# Altium project SecuCar_KeyTag.PrjPcb
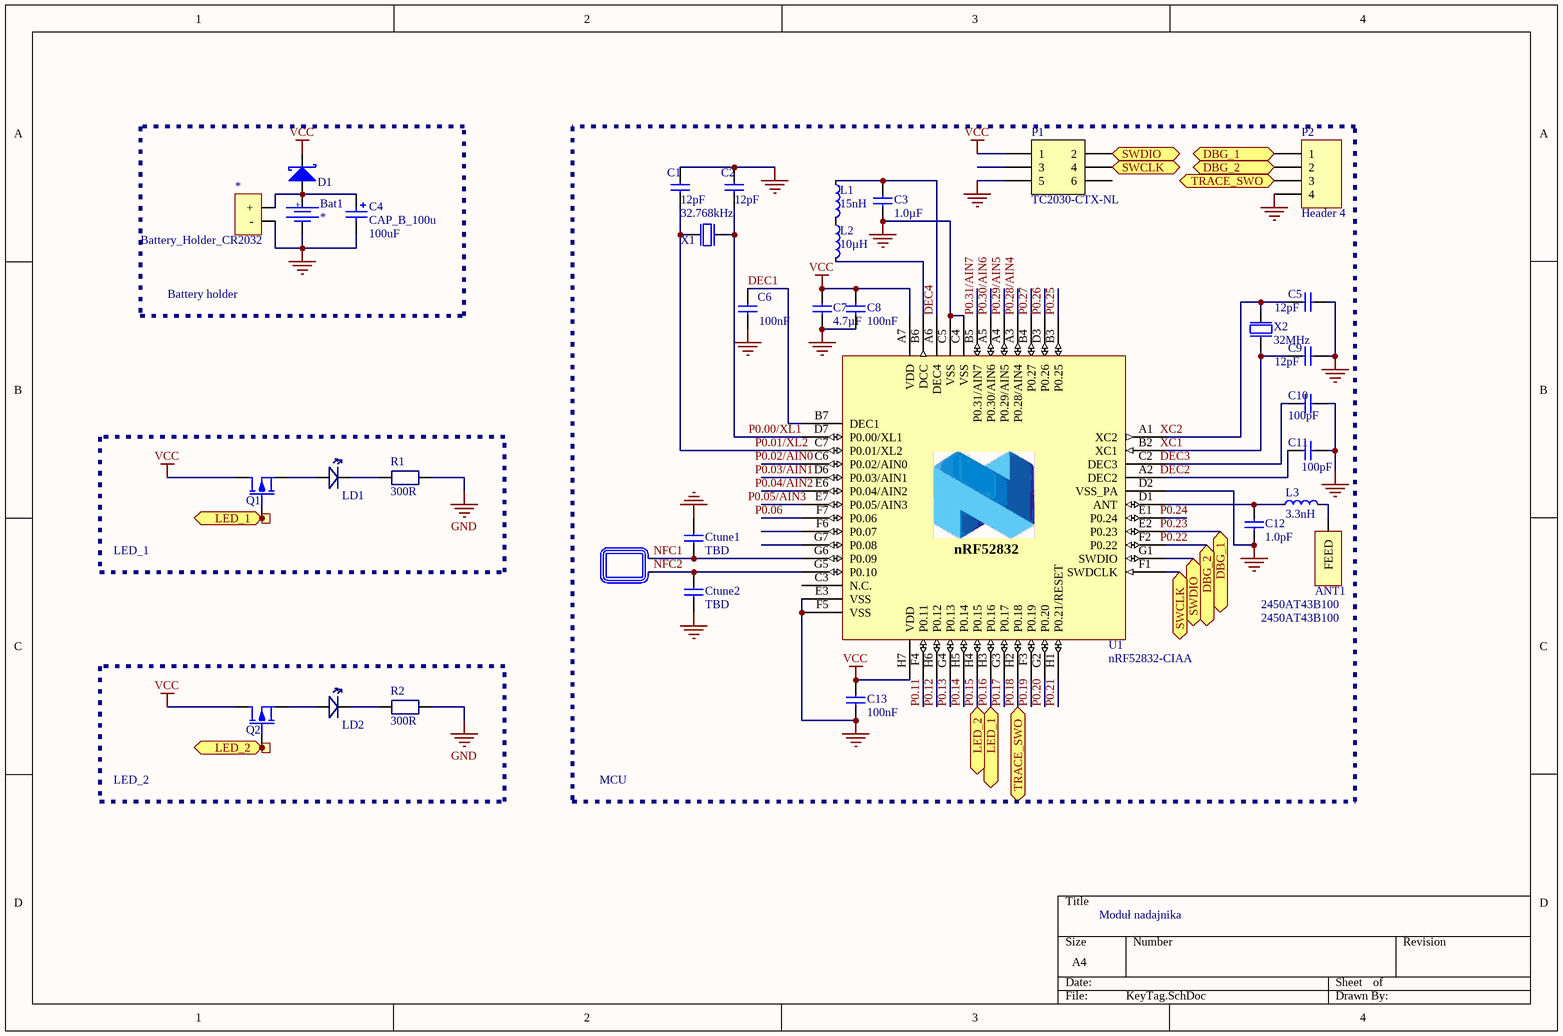
[diagram p0: KeyTag.SchDoc]
1 sheet, 36 parts. Net scope: flat (ports and power ports of the same name join across sheets).
Board file: KeyTagBoard.PcbDoc

## Sheet KeyTag.SchDoc
size A4

### Parts
2  Ø1.0mm,SMD  [TP_SMD_Ř1.0mm]  (value not drawn)  (no BOM)
3  Ø1.0mm,SMD  [TP_SMD_Ř1.0mm]  (value not drawn)  (no BOM)
*  Battery_Holder_CR2032  [CR2032_holder]
A1  NFC Antenna  [TP_2x1mm_TH]  (value not drawn)  (no BOM)
ANT1  2450AT43B100  [2450AT43B100]
Bat1  *  [CR1632_HOLDER_SMD]
C1  12pF  [CAPC0603X03L]
C2  12pF  [CAPC0603X03L]
C3  1.0µF  [CAPC1005X04L]
C4  CAP_B_100u  value 100uF  [B]
C5  12pF  [CAPC0603X03L]
C6  100nF  [CAPC0603X03L]
C7  4.7µF  [CAPC1608X06L]
C8  100nF  [CAPC0603X03L]
C9  12pF  [CAPC0603X03L]
C10  100pF  [CAPC0603X03L]
C11  100pF  [CAPC0603X03L]
C12  1.0pF  [CAPC0603X03L]
C13  100nF  [CAPC0603X03L]
Ctune1  TBD  [CAPC0603X03L]
Ctune2  TBD  [CAPC0603X03L]
D1  Shottky  [DO-214-AA]  (value not drawn)
L1  15nH  [INDC1005X04L]
L2  10µH  [INDC1608X06L]
L3  3.3nH  [INDC0603X03L]
LD1  0603_LED  [LED_0603]  (value not drawn)
LD2  0603_LED  [LED_0603]  (value not drawn)
P1  TC2030-CTX-NL  [TC2030-IDC-NLFP]  (no BOM)
P2  Header 4  [HDR1X4]
Q1  RZE002P02TLTR-ND  [SOT-416]  (value not drawn)
Q2  RZE002P02TLTR-ND  [SOT-416]  (value not drawn)
R1  value 300R  [RES_0402]  (hidden comment: RES_0402_1k)
R2  value 300R  [RES_0402]  (hidden comment: RES_0402_1k)
U1  nRF52832-CIAA  [BGA50C40P7X8_295X322X50]
X1  32.768kHz  [XTAL_2012]
X2  32MHz  [BT-XTAL_2016]

### Blocks framed on the sheet
Battery holder: * Bat1 C4 D1
MCU: A1 ANT1 C1-C3 C5-C13 Ctune1 Ctune2 L1-L3 P1 P2 U1 X1 X2
LED_1: 2 LD1 Q1 R1
LED_2: 3 LD2 Q2 R2

### Ports
DBG_1, DBG_2, LED_1, LED_2, SWCLK, SWDIO, SWDIO (bidir), TRACE_SWO

### Nets
GND: *.2(-) Bat1.2 C1.2 C2.2 C3.1 C4.2 C5.1 C6.2 C7.2 C8.2 C9.1 C10.2 C11.1 C12.1 C13.2 Ctune1.2 Ctune2.1 P1.5 P2.4 R1.1 R2.1 U1.C4(VSS) U1.C5(VSS) U1.D2(VSS_PA) U1.E3(VSS) U1.F5(VSS) X2.2(GND) X2.4(GND)
VCC: C7.1 C8.1 C13.1 D1.2 P1.1 Q1.3 Q2.3 U1.A7(VDD) U1.H7(VDD)
DEC1: C6.1 U1.B7(DEC1)
DEC4: C3.2 L1.1 U1.A6(DEC4)
NFC1: A1.2 Ctune1.1 U1.G6(P0.09)
NFC2: A1.1 Ctune2.2 U1.G5(P0.10)
P0.00/XL1: C2.1 U1.D7(P0.00/XL1) X1.2(out)
P0.01/XL2: C1.1 U1.C7(P0.01/XL2) X1.1(inp)
P0.11: U1.F4(P0.11)
P0.12: U1.H6(P0.12)
P0.13: U1.G4(P0.13)
P0.14: U1.H5(P0.14)
P0.15: 3.1 Q2.1 U1.H4(P0.15) ; port LED_2
P0.16: 2.1 Q1.1 U1.H3(P0.16) ; port LED_1
P0.17: U1.G3(P0.17)
P0.18: P2.3 U1.H2(P0.18) ; port TRACE_SWO
P0.19: U1.F3(P0.19)
P0.20: U1.G2(P0.20)
P0.21: U1.H1(P0.21/RESET)
P0.25: U1.B3(P0.25)
P0.26: U1.D3(P0.26)
P0.27: U1.B4(P0.27)
P0.28/AIN4: U1.A3(P0.28/AIN4)
P0.29/AIN5: U1.A4(P0.29/AIN5)
P0.30/AIN6: U1.A5(P0.30/AIN6)
P0.31/AIN7: U1.B5(P0.31/AIN7)
Net*_1: *.1(+) Bat1.1 C4.1 D1.1
NetANT1_1: ANT1.1(FEED) L3.2
NetC5_2: C5.2 U1.A1(XC2) X2.3(out)
NetC9_2: C9.2 U1.B2(XC1) X2.1(inp)
NetC10_1: C10.1 U1.C2(DEC3)
NetC11_2: C11.2 U1.A2(DEC2)
NetC12_2: C12.2 L3.1 U1.D1(ANT)
NetL1_2: L1.2 L2.1
NetL2_2: L2.2 U1.B6(DCC)
NetLD1_1: LD1.1(A) Q1.2
NetLD1_2: LD1.2(K) R1.2
NetLD2_1: LD2.1(A) Q2.2
NetLD2_2: LD2.2(K) R2.2
NetP1_2: P1.2 U1.G1(SWDIO) ; port SWDIO
NetP1_4: P1.4 U1.F1(SWDCLK) ; port SWCLK
NetP2_1: P2.1 U1.E2(P0.23) ; port DBG_1
NetP2_2: P2.2 U1.F2(P0.22) ; port DBG_2

Not connected (* = marked no-connect by the designer): P1 3 6; U1 C3(N.C.) C6(P0.02/AIN0) D6(P0.03/AIN1) E1(P0.24) E6(P0.04/AIN2) E7(P0.05/AIN3) F6(P0.07) F7(P0.06) G7(P0.08)

### Notes on the sheet
- Moduł nadajnika
- Labels drawn without touching a wire or pin: DEC2, DEC3, P0.02/AIN0, P0.03/AIN1, P0.04/AIN2, P0.05/AIN3, P0.06, P0.22, P0.23, P0.24, XC1, XC2
- (in symbol Bat Holder CR1632 SMD) +
- (in symbol nRF52832-CIAA) nRF52832

### Library data of the parts
2 3 = TESTPAD: 1.0mm circular SMD testpad; Part Number: TP_SMD_Ø1.0MM; Manufacturer: Nordic Semiconductor; Artikkelnr Noca: N.A.; Manufacturer Part Number: *; Datasheet: *; Footprint: TP_SMD_Ø1.0mm; LatestRevisionDate: 2013-06-11; Pin Count: 1; Publisher: Nordic Semiconductor; Published: 2013-06-11; Value: Ø1.0mm,SMD; Note: *; Supplier: *; Supplier part number: *; 2nd source Supplier: *; 2nd source part number: *
A1 = NFC_ANT_TP: Artikkelnr Noca: N.A.; Part Number: NFC_ANT_TP; Manufacturer: *; Manufacturer Part Number: *; Datasheet: *; Footprint Doc: TP_2x1mm_TH; LatestRevisionDate: 2016-02-23; Pin Count: 2; Publisher: Nordic Semiconductor; Published: 2016-02-23; Value: NFC Antenna; Note: *; Supplier: *; Supplier part number: *; 2nd source Supplier: *; 2nd source part number: *; Artikkelnr Simpro: N.A.
Bat1 = Bat Holder CR1632 SMD: Manufacturer: Keystone; Manufacturer Part Number: 3012; 2nd source part number: 165-0697; Artikkelnr Noca: N.A.; Part Number: Bat Holder CR1632 SMD; Datasheet: http://www.keyelco.com/product-pdf.cfm?p=790; LatestRevisionDate: 2014-01-13; Pin Count: 3; Publisher: Nordic Semiconductor; Published: 2014-01-13; Value: Bat Holder CR1632; Note: *; Supplier: Digi-Key; Supplier part number: 3012K-ND; 2nd source Supplier: Farnell
C1 C2 C5 C9 = C0201-12p: Capacitor, NP0, ±2%; Note: 50V; Artikkelnr Noca: N.A.; Part Number: C0201-12p; Manufacturer: *; Manufacturer Part Number: *; Datasheet: *; LatestRevisionDate: 2014-11-13; Pin Count: 2; Publisher: Nordic Semiconductor; Published: 2014-11-13; Value: 12pF; Supplier: *; Supplier part number: *; 2nd source Supplier: *; 2nd source part number: *; Footprint Doc: 0201; Artikkelnr Simpro: N.A.
C3 = C0402-1µ0: Capacitor, X5R, ±5%; Note: 6.3V; Artikkelnr Noca: 20039235; Artikkelnr Simpro: N.A.; Part Number: C0402-1µ0; Manufacturer: *; Manufacturer Part Number: *; Datasheet: *; LatestRevisionDate: 2009-11-23; Pin Count: 2; Publisher: Nordic Semiconductor; Published: 2009-05-08; Value: 1.0µF; Supplier: *; Supplier part number: *; 2nd source Supplier: *; 2nd source part number: *; Footprint Doc: 0402
C4 = CAP_B_100u: Solid Tantalum Capacitor; Supplier 1: TME; Supplier 2: TME; Supplier 3: Digi-Key; Supplier Part Number 1: TAJB107K006R; Supplier Part Number 2: TAJB107M006R; Supplier Part Number 3: 399-3688-2-ND
C6 C8 C13 = C0201-100n: Capacitor, X7R, ±10%; Note: 16V; Artikkelnr Noca: N.A.; Part Number: C0201-100n; Manufacturer: *; Manufacturer Part Number: *; Datasheet: *; LatestRevisionDate: 2014-11-13; Pin Count: 2; Publisher: Nordic Semiconductor; Published: 2014-11-13; Value: 100nF; Supplier: *; Supplier part number: *; 2nd source Supplier: *; 2nd source part number: *; Footprint Doc: 0201; Artikkelnr Simpro: N.A.
C7 = C0603-4µ7: Capacitor, X5R, ±10%; Note: 6.3V; Artikkelnr Noca: 20069060; Artikkelnr Simpro: N.A.; Part Number: C0603-4µ7; Manufacturer: *; Manufacturer Part Number: *; Datasheet: *; LatestRevisionDate: 2009-11-23; Pin Count: 2; Publisher: Nordic Semiconductor; Published: 2009-05-08; Value: 4.7µF; Supplier: *; Supplier part number: *; 2nd source Supplier: *; 2nd source part number: *; Footprint Doc: 0603
C10 C11 = C0201-100p: Capacitor, NP0, ±5%; Note: Chip Cap 1%; Artikkelnr Noca: N.A.; Part Number: C0201-100p; Manufacturer: *; Manufacturer Part Number: *; Datasheet: *; LatestRevisionDate: 2014-11-13; Pin Count: 2; Publisher: Nordic Semiconductor; Published: 2014-11-13; Value: 100pF; Supplier: *; Supplier part number: *; 2nd source Supplier: *; 2nd source part number: *; Footprint Doc: 0201; Artikkelnr Simpro: N.A.
C12 = C0201-1.0p: Capacitor, NP0, ±5%; Note: Chip Cap 1%; Artikkelnr Noca: N.A.; Part Number: C0201-1.0p; Manufacturer: *; Manufacturer Part Number: *; Datasheet: *; LatestRevisionDate: 2014-11-13; Pin Count: 2; Publisher: Nordic Semiconductor; Published: 2014-11-13; Value: 1.0pF; Supplier: *; Supplier part number: *; 2nd source Supplier: *; 2nd source part number: *; Footprint Doc: 0201; Artikkelnr Simpro: N.A.
Ctune1 Ctune2 = C0201-TBD: Capacitor, NP0, ±5%; Note: Chip Cap; Artikkelnr Noca: N.A.; Part Number: C0201-TBD; Manufacturer: *; Manufacturer Part Number: *; Datasheet: *; Footprint Doc: 0201; LatestRevisionDate: 2014-11-13; Pin Count: 2; Publisher: Nordic Semiconductor; Published: 2014-11-13; Value: TBD; Supplier: *; Supplier part number: *; 2nd source Supplier: *; 2nd source part number: *; Artikkelnr Simpro: N.A.
D1 = Shottky_diode
L1 = L0402-15n: High frequency chip inductor ±10%; Manufacturer: Taiyo Yuden; Manufacturer Part Number: HK100515NJ-T; 2nd source part number: 658-1328; Artikkelnr Noca: 33029323; Artikkelnr Simpro: N.A.; Part Number: L0402-15n; LatestRevisionDate: 2012-09-19; Pin Count: 2; Publisher: Nordic Semiconductor; Published: 2010-07-12; Value: 15nH; Note: High frequency chip inductor ±10%; Supplier: Digi-Key; Datasheet: http://www.yuden.co.jp/productdata/catalog/en/mlci04_e.pdf; Supplier part number: 587-1521-1-ND; 2nd source Supplier: Farnell; Footprint Doc: 0402
L2 = L0603-10µ: Chip inductor, IDC,min = 50 mA, ±20%; Manufacturer: Taiyo Yuden; Manufacturer Part Number: LBMF1608T100K; 2nd source part number: 178-6105; Note: LBMF1608T100K 10µH 80mA 0603; Artikkelnr Noca: 33029314; Artikkelnr Simpro: N.A.; Part Number: L0603-10µ; Datasheet: http://www.yuden.co.jp/ut/product/pdf/elb2_e.pdf; LatestRevisionDate: 2012-09-19; Pin Count: 2; Publisher: Nordic Semiconductor; Published: 2010-02-24; Value: 10µH; Supplier: Digi-Key; Supplier part number: 587-1714-1-ND; 2nd source Supplier: Farnell; Footprint Doc: 0603
L3 = L0201-3n3: High frequency chip inductor ±5%; Artikkelnr Noca: N.A.; Part Number: L0201-3n3; Manufacturer: *; Manufacturer Part Number: *; Datasheet: *; LatestRevisionDate: 2013-04-10; Pin Count: 2; Publisher: Nordic Semiconductor; Published: 2013-04-10; Value: 3.3nH; Note: High frequency chip inductor ±5%; Supplier: *; Supplier part number: *; 2nd source Supplier: *; 2nd source part number: *; Footprint Doc: 0201; Artikkelnr Simpro: N.A.
LD1 LD2 = LED_0603_Blue: Supplier 1: Digi-Key; Supplier 2: TME; Supplier 3: TME; Supplier 4: TME; Supplier 5: TME; Supplier Part Number 1: 160-1647-2-ND; Supplier Part Number 2: LL-S192PBC-B4-1B; Supplier Part Number 3: LL-S194PBC-B4-1B; Supplier Part Number 4: OF-SMD1608B; Supplier Part Number 5: OSB50603C1D
P1 = TC2030-CTX-NL: CBL PLUG-OF-NAILS 6-PIN; Manufacturer: Tag-Connect LLC; Artikkelnr Noca: N.A.; Part Number: TC2030-CTX-NL; Manufacturer Part Number: TC2030-CTX-NL; Datasheet: http://www.tag-connect.com/Materials/TC2030-IDC-NL.pdf; LatestRevisionDate: 2013-08-08; Pin Count: 6; Publisher: Nordic Semiconductor; Published: 2013-08-08; Value: TC2030-CTX-NL; Supplier: Tag-Connect; Supplier part number: TC2030-CTX-NL; 2nd source Supplier: *; 2nd source part number: *
P2 = Header 4: Header, 4-Pin; LatestRevisionDate: 17-Jul-2002; LatestRevisionNote: Re-released for DXP Platform.; Publisher: Altium Limited
U1 = nRF52832-CIAA: Multi-protocol Bluetooth Low Energy, ANT and 2.4GHz proprietary system-on-chip; Manufacturer: Nordic Semiconductor; Artikkelnr Noca: N.A.; Part Number: nRF52832-CIAA; Manufacturer Part Number: nRF52832-CIAA; Datasheet: *; LatestRevisionDate: 2016-03-11; Pin Count: 54; Publisher: Nordic Semiconductor; Published: 2016-03-11; Value: nRF52832-CIAA; Note: *; Supplier: Nordic Semiconductor; Supplier part number: *; 2nd source Supplier: *; 2nd source part number: *; Footprint Doc: WLCSP_C50; Artikkelnr Simpro: N.A.; Part number IPS: N.A.
X1 = XTAL_SMD2012_32.768kHz_9pF_Seiko: XTAL SMD 2012, 32.768kHz, Cl=9pF, Total Tol: ±50ppm; Manufacturer: Seiko; Manufacturer Part Number: SC20S-9.0PF20PPM; Note: XTAL SMD 32.768kHz, 2012; Artikkelnr Noca: N.A.; Part Number: XTAL_SMD2012_32.768kHz_9pF_Seiko; Datasheet: http://www.sii.co.jp/en/quartz/files/2013/03/file_PRODUCT_MASTER_50811_GRAPHIC03.pdf; LatestRevisionDate: 2015-10-15; Pin Count: 2; Publisher: Nordic Semiconductor; Published: 2015-10-15; Value: 32.768kHz; Supplier: *; Supplier part number: *; 2nd source Supplier: *; 2nd source part number: *; Footprint Doc: XTAL_2012; Artikkelnr Simpro: N.A.
X2 = XTAL_SMD2016_32MHz_8pF_Epson: XTAL SMD 2016, 32MHz, Cl=8pF, Total Tol: ±40ppm; Manufacturer: Epson Toyocom; Manufacturer Part Number: Q22FA12800025; Note: XTAL SMD 32.000MHz; Artikkelnr Noca: N.A.; Part Number: XTAL_SMD2016_32MHz_8pF_Epson; Datasheet: http://www.epsondevice.com/docs/qd/en/DownloadServlet?id=ID000449; LatestRevisionDate: 2014-11-27; Pin Count: 4; Publisher: Nordic Semiconductor; Published: 2012-03-09; Value: 32MHz; Supplier: Farnell; Supplier part number: 171-2806; 2nd source Supplier: *; 2nd source part number: *; Footprint Doc: XTAL_2016; Artikkelnr Simpro: N.A.
ANT1 = 2450AT43B100: Supplier 1: Mouser; Supplier 2: Farnell; Supplier 3: Farnell; Supplier 4: Digi-Key; Supplier 5: Digi-Key; Supplier 6: Digi-Key; Supplier Part Number 1: 609-2450AT43B100E; Supplier Part Number 2: 2148524; Supplier Part Number 3: 2148524RL; Supplier Part Number 4: 712-1010-2-ND; Supplier Part Number 5: 712-1010-1-ND; Supplier Part Number 6: 712-1010-6-ND; Value: 2450AT43B100
Q1 Q2 = RZE002P02TLTR-ND: Supplier 1: Digi-Key; Supplier 2: Digi-Key; Supplier 3: Digi-Key; Supplier Part Number 1: RZE002P02TLTR-ND; Supplier Part Number 2: RZE002P02TLCT-ND; Supplier Part Number 3: RZE002P02TLDKR-ND; Value: RZE002P02TL
R1 R2 = RES_0402_1k: Supplier 1: Digi-Key; Supplier 2: Farnell; Supplier 3: Mouser; Supplier Part Number 1: 311-1.0KJRTR-ND; Supplier Part Number 2: 1358043; Supplier Part Number 3: 603-RC0402FR-071KL